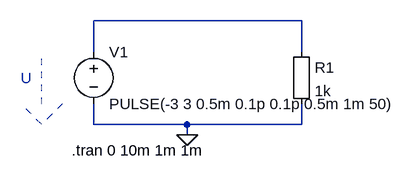
[diagram p0: schematic Draft2.asc]
Draft2.asc, the LTspice schematic file:
Version 4
SHEET 1 880 680
WIRE 400 80 80 80
WIRE 80 128 80 80
WIRE 400 128 400 80
WIRE 80 240 80 208
WIRE 224 240 80 240
WIRE 400 240 400 208
WIRE 400 240 224 240
WIRE 224 256 224 240
FLAG 224 256 0
SYMBOL voltage 80 112 R0
WINDOW 123 0 0 Left 0
WINDOW 39 0 0 Left 0
SYMATTR InstName V1
SYMATTR Value PULSE(-3 3 0.5m 0.1p 0.1p 0.5m 1m 50)
SYMBOL Misc\\EuropeanResistor 384 112 R0
SYMATTR InstName R1
SYMATTR Value 1k
TEXT 46 280 Left 2 !.tran 0 10m 1m 1m
TEXT -32 168 Left 2 ;U
LINE Normal 0 208 0 128 2
LINE Normal 0 240 -32 208 2
LINE Normal 32 208 0 240 2

The netlist it stands for:
* Draft2.asc
V1 N001 0 PULSE(-3 3 0.5m 0.1p 0.1p 0.5m 1m 50)
R1 N001 0 1k
.tran 0 10m 1m 1m
* U
.backanno
.end